# EAGLE design PCB_acquiCapteur_Schema (EAGLE 9.6.2)
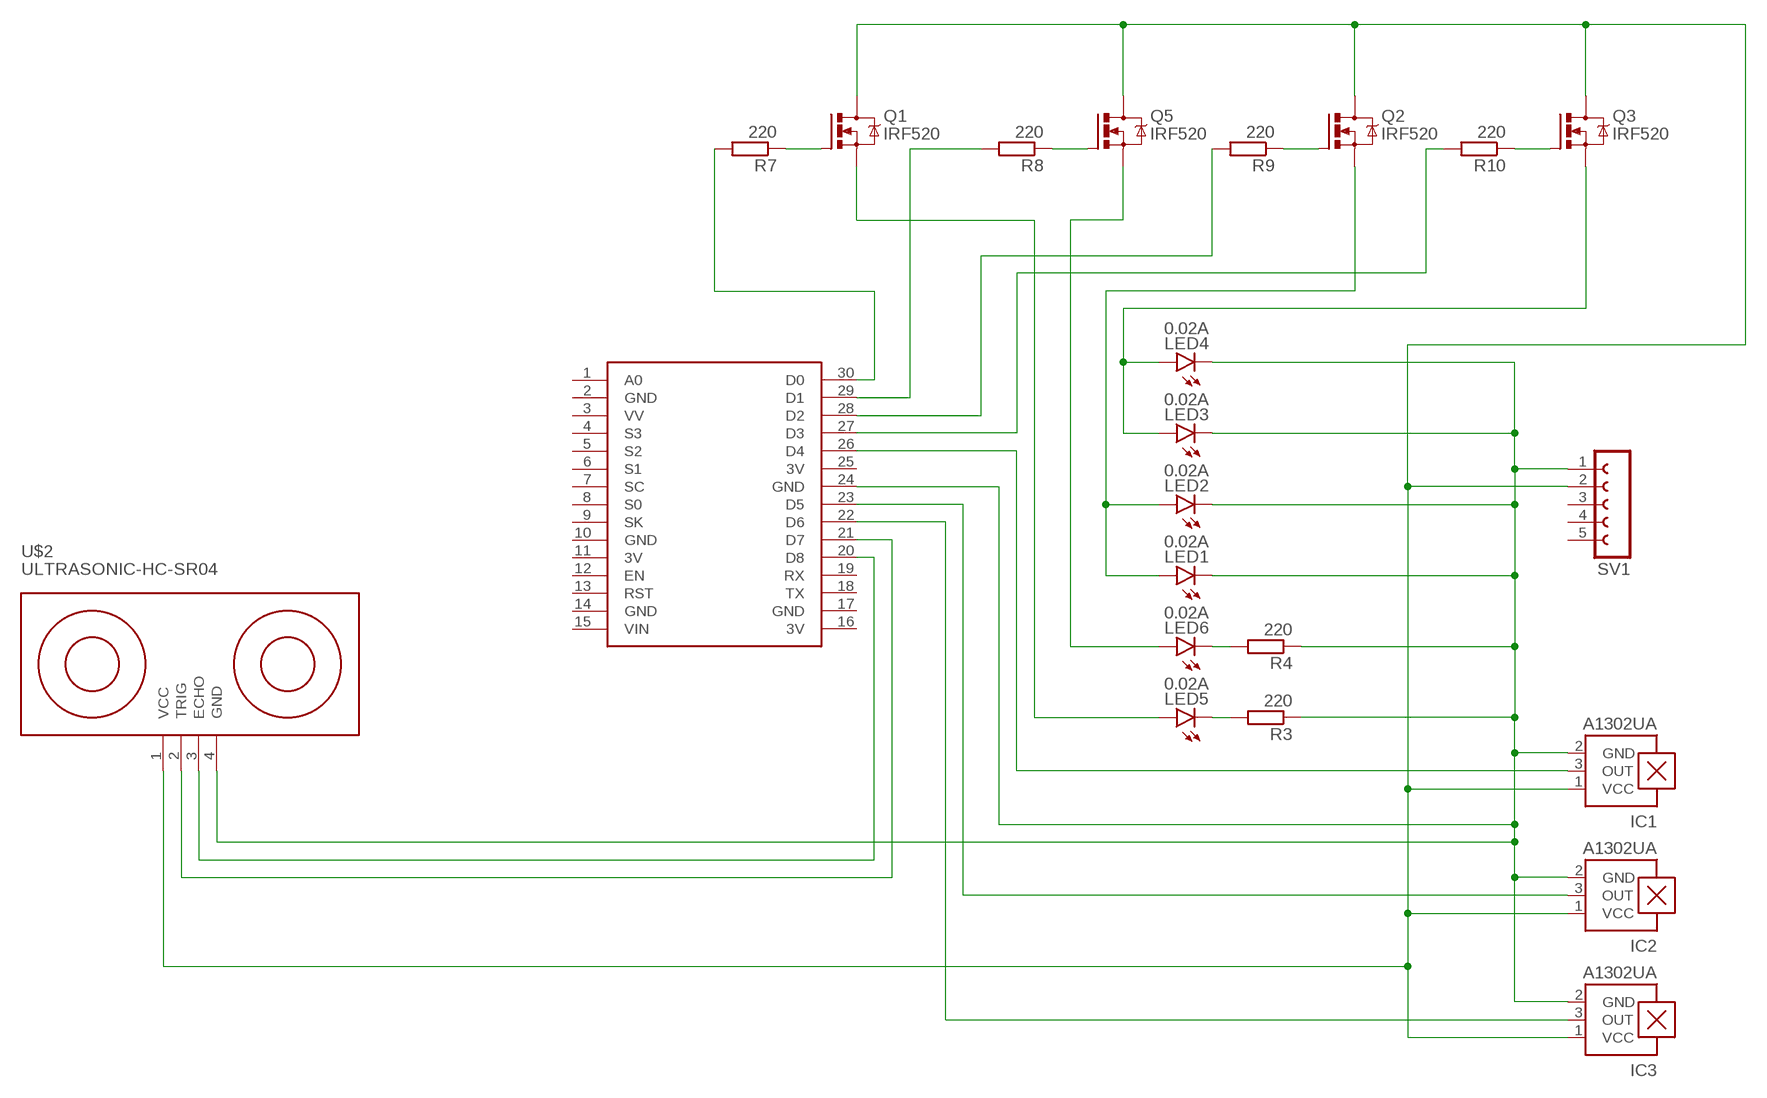
[diagram p0: schematic, sheet 1]

## Parts
IC1  A1302UA  [SIP3-UA]
IC2  A1302UA  [SIP3-UA]
IC3  A1302UA  [SIP3-UA]
LED1  0.02A  LEDLSU260  [LSU260]
LED2  0.02A  LEDLSU260  [LSU260]
LED3  0.02A  LEDLSU260  [LSU260]
LED4  0.02A  LEDLSU260  [LSU260]
LED5  0.02A  LEDLSU260  [LSU260]
LED6  0.02A  LEDLSU260  [LSU260]
Q1  IRF520  NMOSFET_IRF520-TO220  [TO220BV]
Q2  IRF520  NMOSFET_IRF520-TO220  [TO220BV]
Q3  IRF520  NMOSFET_IRF520-TO220  [TO220BV]
Q5  IRF520  NMOSFET_IRF520-TO220  [TO220BV]
R3  220  R-EU_0207/10  [0207/10]
R4  220  R-EU_0207/10  [0207/10]
R7  220  R-EU_0207/10  [0207/10]
R8  220  R-EU_0207/10  [0207/10]
R9  220  R-EU_0207/10  [0207/10]
R10  220  R-EU_0207/10  [0207/10]
SV1  FE05-1  [FE05-1]
U$1  NODEMCU  [NODEMCU]
U$2  ULTRASONIC-HC-SR04  [ULTRASONIC-HC-SR04]

## Nets
N$2: LED5.K(C) R3.2
N$3: LED6.K(C) R4.2
N$7: IC1.2(GND) IC2.2(GND) IC3.2(GND) LED1.K(C) LED2.K(C) LED3.K(C) LED4.K(C) R3.1 R4.1 SV1.1 U$1.24(GND) U$2.4(GND)
N$8: Q1.G R7.1
N$9: Q5.G R8.1
N$10: Q2.G R9.1
N$11: IC1.3(OUT) U$1.26(D4)
N$12: IC2.3(OUT) U$1.23(D5)
N$13: IC3.3(OUT) U$1.22(D6)
N$14: IC1.1(VCC) IC2.1(VCC) IC3.1(VCC) Q1.D Q2.D Q3.D Q5.D SV1.2 U$2.1(VCC)
N$15: U$1.20(D8) U$2.3(ECHO)
N$16: U$1.21(D7) U$2.2(TRIG)
N$17: Q3.G R10.1
N$18: R7.2 U$1.30(D0)
N$19: R8.2 U$1.29(D1)
N$20: R9.2 U$1.28(D2)
N$22: LED3.A LED4.A Q3.S
N$23: LED1.A LED2.A Q2.S
N$24: LED6.A Q5.S
N$25: LED5.A Q1.S
N$26: R10.2 U$1.27(D3)
Unconnected: SV1.3 SV1.4 SV1.5 U$1.1(A0) U$1.3(VV) U$1.4(S3) U$1.5(S2) U$1.6(S1) U$1.7(SC) U$1.8(S0) U$1.9(SK) U$1.12(EN) U$1.13(RST) U$1.15(VIN) U$1.18(TX) U$1.19(RX)

## Power pins joined to a net without a drawn wire
3V: U$1.11(3V) U$1.16(3V) U$1.25(3V)
GND: U$1.2(GND) U$1.10(GND) U$1.14(GND) U$1.17(GND)

## Library data of the parts
IC1-IC3 = allegro:A13*?: Linear Hall Effect Sensor ICs Continuous-Time Ratiometric High-Temperature Operation Programmable Linear with Analog Output A1302 -Replacement- UGN3503 Source: http://www.allegromicro.com/en/Products/Part_Numbers/1301/1301.pdf http://www.allegromicro.com/en/Products/Part_Numbers/1321/1321.pdf http://www.allegromicro.com/en/Products/Part_Numbers/1381/1381.pdf; MF: ALLEGRO MICROSYSTEMS, INC.; MPN: A1302EUA-T; OC_FARNELL: 1521708; OC_NEWARK: 31K6639
LED1-LED6 = led:LED: LED OSRAM: - CHIPLED LG R971, LG N971, LY N971, LG Q971, LY Q971, LO R971, LY R971 LH N974, LH R974 LS Q976, LO Q976, LY Q976 LO Q996 - Hyper CHIPLED LW Q18S LB Q993, LB Q99A, LB R99A - SideLED LS A670, LO A670, LY A670, LG A670, LP A670 LB A673, LV A673, LT A673, LW A673 LH A674 LY A675 LS A676, LA A676, LO A676, LY A676, LW A676 LS A679, LY A679, LG A679 - Hyper Micro SIDELED® LS Y876, LA Y876, LO Y876, LY Y876 LT Y87S - SmartLED LW L88C, LW L88S LB L89C, LB L89S, LG L890 LS L89K, LO L89K, LY L89K LS L896, LA L896, LO L896, LY L896 - TOPLED LS T670, LO T670, LY T670, LG T670, LP T670 LSG T670, LSP T670, LSY T670, LOP T670, LYG T670 LG T671, LOG T671, LSG T671 LB T673, LV T673, LT T673, LW T673 LH T674 LS T676, LA T676, LO T676, LY T676, LB T676, LH T676, LSB T676, LW T676 LB T67C, LV T67C, LT T67C, LS T67K, LO T67K, LY T67K, LW E67C LS E67B, LA E67B, LO E67B, LY E67B, LB E67C, LV E67C, LT E67C LW T67C LS T679, LY T679, LG T679 LS T770, LO T770, LY T770, LG T770, LP T770 LB T773, LV T773, LT T773, LW T773 LH T774 LS E675, LA E675, LY E675, LS T675 LS T776, LA T776, LO T776, LY T776, LB T776 LHGB T686 LT T68C, LB T68C - Hyper Mini TOPLED® LB M676 - Mini TOPLED Santana® LG M470 LS M47K, LO M47K, LY M47K Source: http://www.osram.convergy.de LUXEON: - LUMILED® LXK2-PW12-R00, LXK2-PW12-S00, LXK2-PW14-U00, LXK2-PW14-V00 LXK2-PM12-R00, LXK2-PM12-S00, LXK2-PM14-U00 LXK2-PE12-Q00, LXK2-PE12-R00, LXK2-PE12-S00, LXK2-PE14-T00, LXK2-PE14-U00 LXK2-PB12-K00, LXK2-PB12-L00, LXK2-PB12-M00, LXK2-PB14-N00, LXK2-PB14-P00, LXK2-PB14-Q00 LXK2-PR12-L00, LXK2-PR12-M00, LXK2-PR14-Q00, LXK2-PR14-R00 LXK2-PD12-Q00, LXK2-PD12-R00, LXK2-PD12-S00 LXK2-PH12-R00, LXK2-PH12-S00 LXK2-PL12-P00, LXK2-PL12-Q00, LXK2-PL12-R00 Source: www.luxeon.com KINGBRIGHT: KA-3528ASYC Source: www.kingbright.com
Q1-Q3 Q5 = Transistor:NMOSFET_: N-Channel MOSFET - Popular parts; CATEGORY: Transistor; DESCRIPTION: MOSFET N-CH 100V 9.7A TO-220AB; DRAIN_CURRENT: 9.7A; MANUFACTURER: Infineon Technologies; MPN: IRF520NPBF; OPERATING_TEMP: -55°C ~ 175°C; PART_STATUS: Active; ROHS_COMPLIANT: Yes; SUB-CATEGORY: MOSFET; THERMALLOSS: 48W; TYPE: N-Channel
R3 R4 R7-R10 = rcl:R-EU_: RESISTOR, European symbol; SPICEPREFIX: R
SV1 = con-lsta:FE05-1: FEMALE HEADER; OC_FARNELL: unknown; OC_NEWARK: unknown
U$1 = nodemcu:NODEMCU
U$2 = diy-modules:ULTRASONIC-HC-SR04: Ultrasonic Ranging Module HC-SR04 More details available here: http://randomnerdtutorials.com/complete-guide-for-ultrasonic-sensor-hc-sr04/ Click here to find device on ebay.com <http://www.ebay.com/sch/hc+sr04+ultrasonic>

## Board
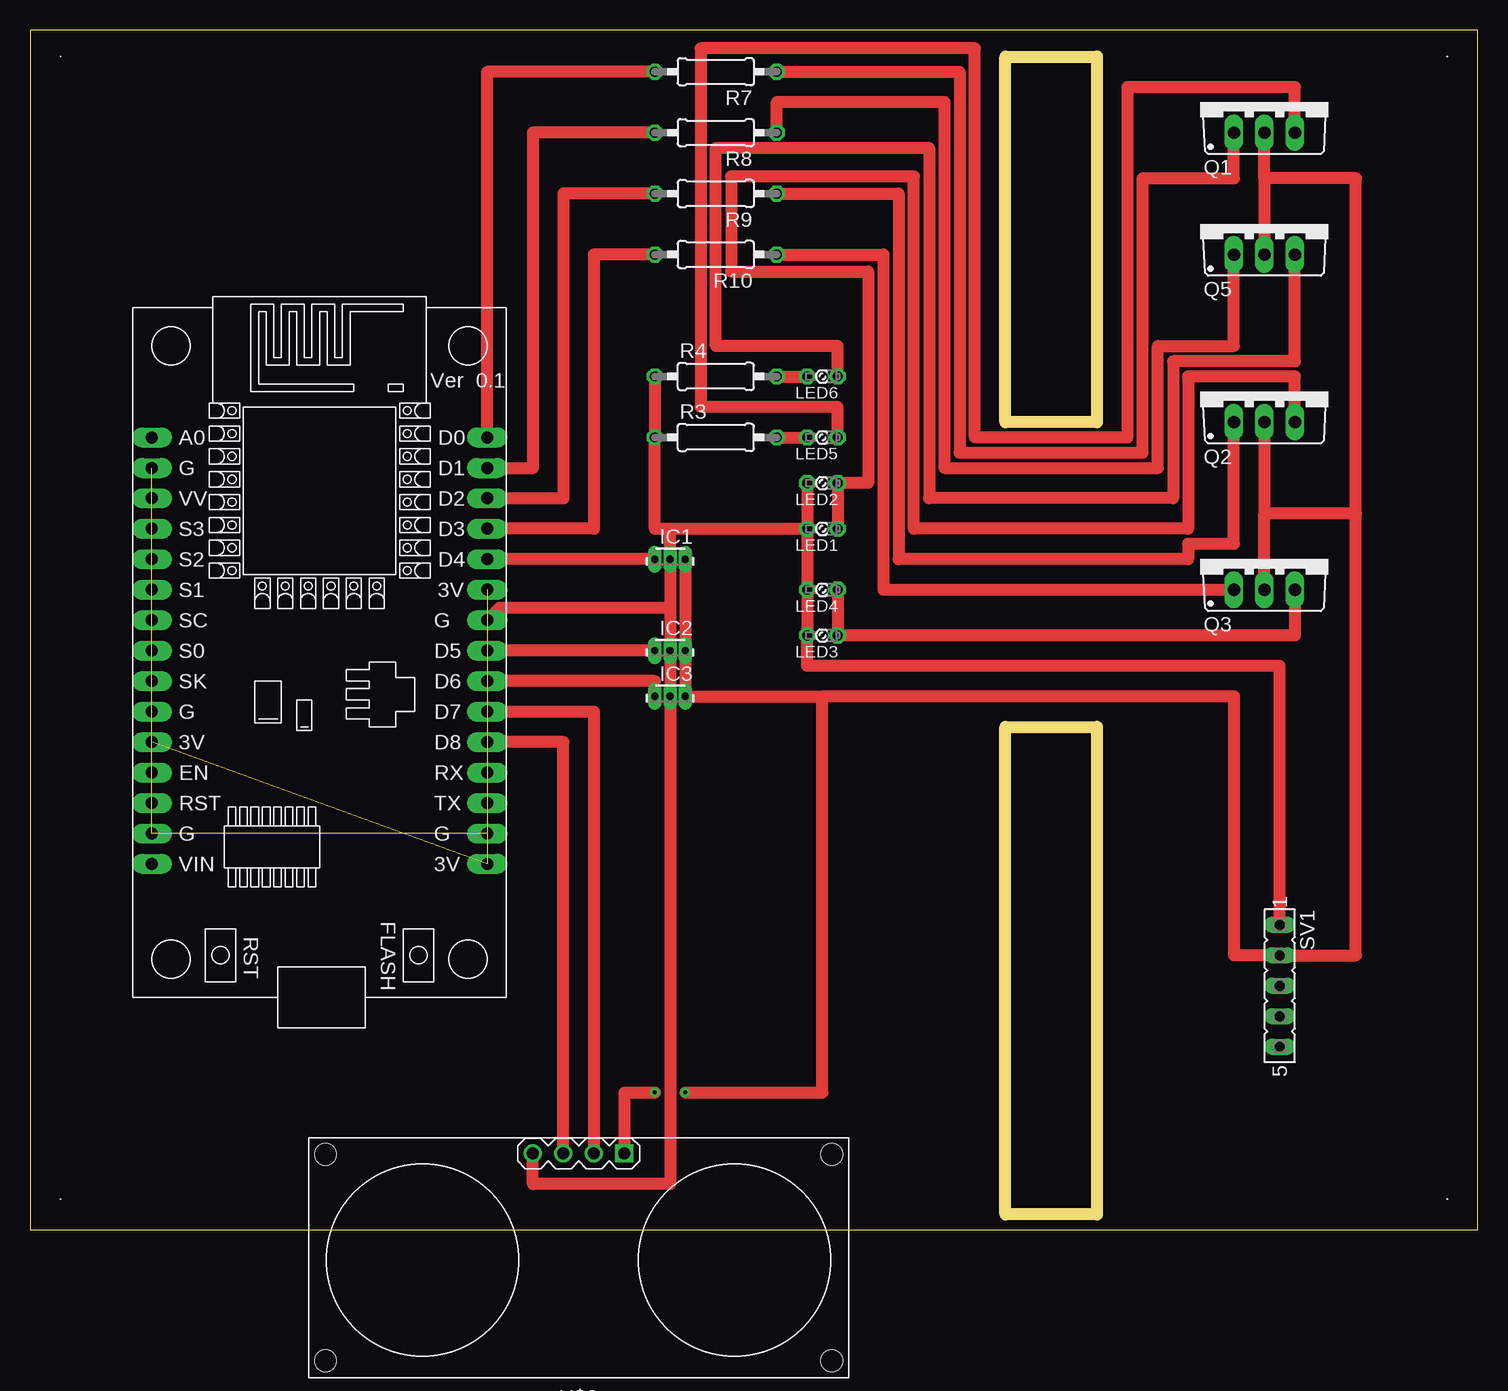
[diagram p1: board, top side]
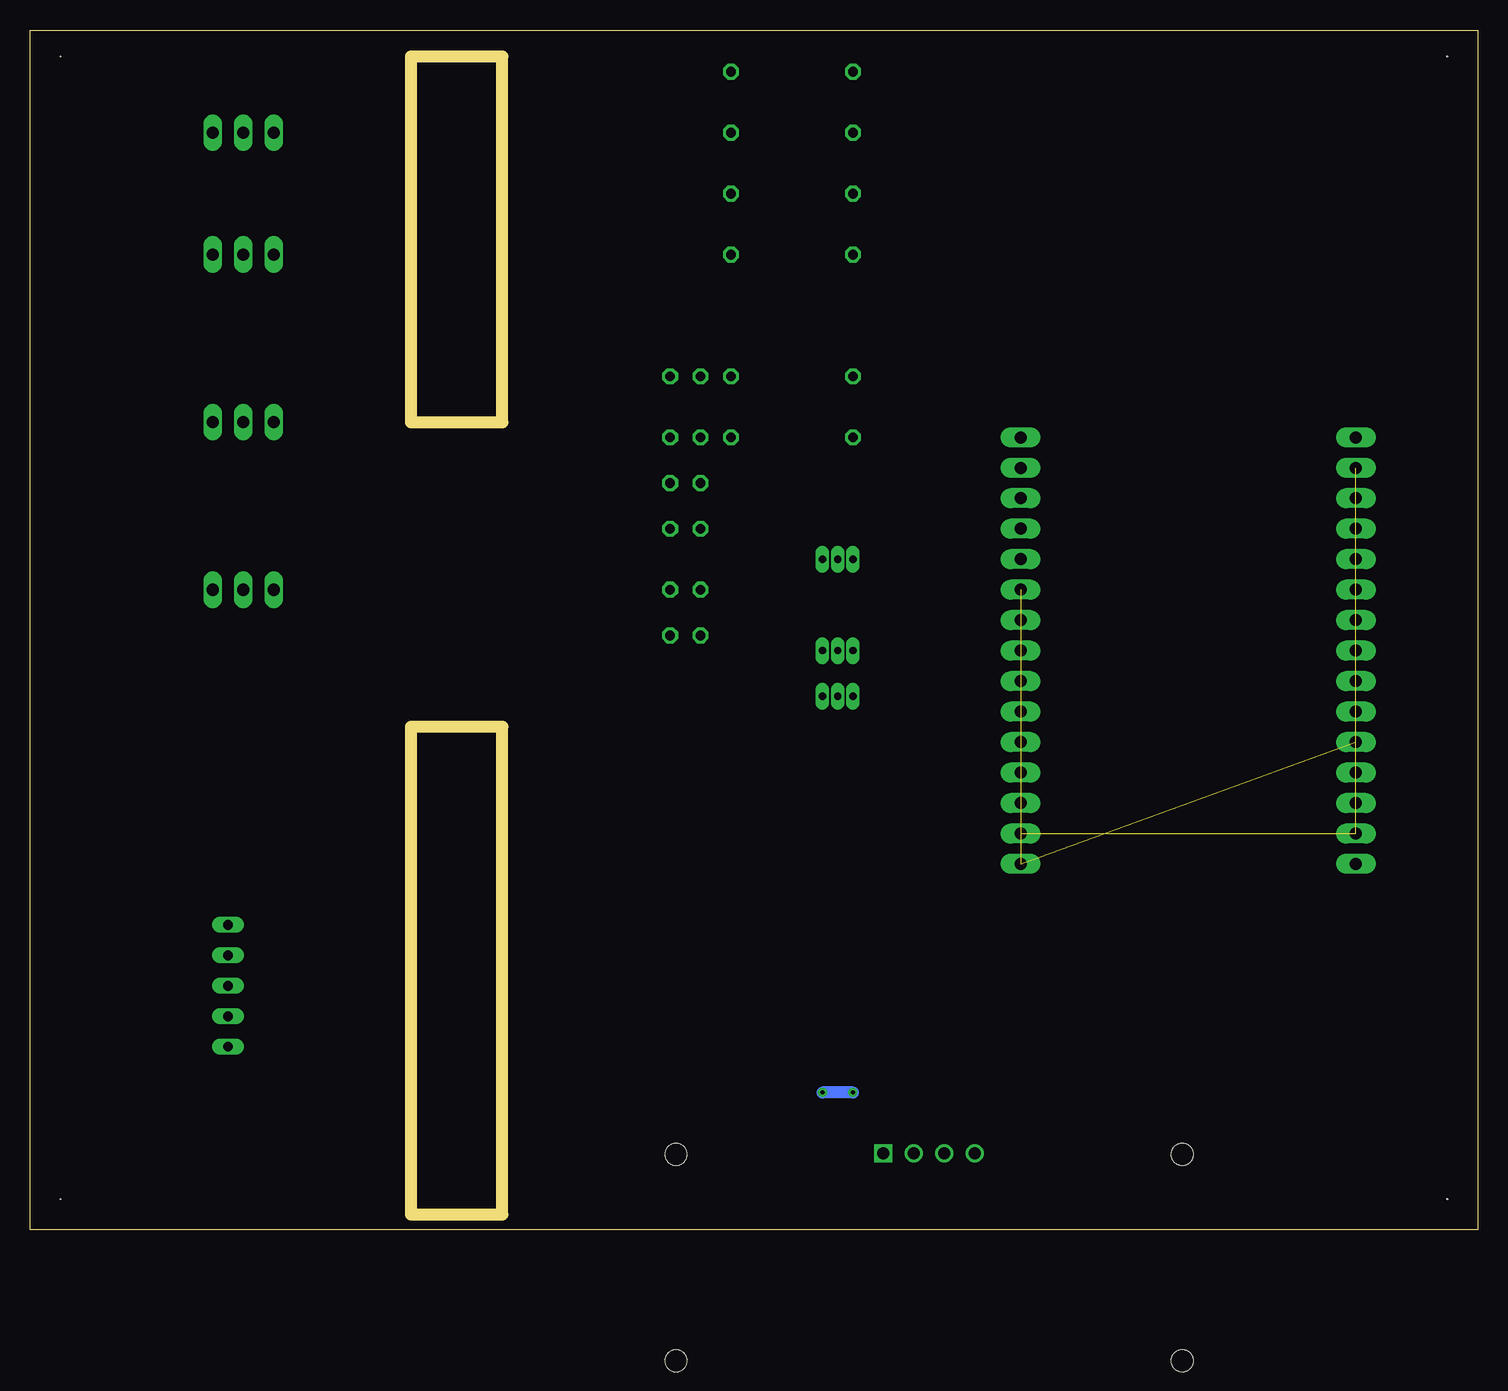
[diagram p2: board, bottom side, seen from below]

Size 120.65 x 100 mm. Coordinates in mm from the lower left corner, seen from the top.
Outline: 0,0 120.63,0 120.63,32.97 120.65,33.07 120.63,100 0,100 0,0
Copper layers (1*16): Top 0.035mm / dielectric 1.5mm / Bottom 0.035mm
Design rules "default": minimum track width 6mil, minimum drill 0.35mm, track to track 6mil, track to pad 6mil, pad to pad 6mil, via to via 6mil, smd to smd 6mil, copper to edge 40mil, drill to drill 6mil, minimum pad ring 10mil, minimum via ring 8mil, stop-mask expansion 4mil, vias tented up to drill 0mil, thermal gap 10mil
Holes 0.06 mm at 2.54,97.79 2.54,2.54 118.11,2.54 118.11,97.79
Milling: 8 lines

### Footprints (pad centres in the part's own frame; a part is rotated, then mirrored left to right if it is on the bottom)
SIP3-UA = drill 0.6 pad 0.7 long: 1 -1.27,0; 2 0,0; 3 1.27,0
LSU260 = drill 0.813 octagon: A -1.27,0; K 1.27,0
TO220BV = drill 1.016 long: D 0,-2.54; G -2.54,-2.54; S 2.54,-2.54
0207/10 = drill 0.813 octagon: 1 -5.08,0; 2 5.08,0
FE05-1 = drill 0.813 long: 1 -5.08,0; 2 -2.54,0; 3 0,0; 4 2.54,0; 5 5.08,0
NODEMCU = drill 1 pad 1.676 long: 1 -13.97,17.78; 2 -13.97,15.24; 3 -13.97,12.7; 4 -13.97,10.16; 5 -13.97,7.62; 6 -13.97,5.08; 7 -13.97,2.54; 8 -13.97,0; 9 -13.97,-2.54; 10 -13.97,-5.08; 11 -13.97,-7.62; 12 -13.97,-10.16; 13 -13.97,-12.7; 14 -13.97,-15.24; 15 -13.97,-17.78; 16 13.97,-17.78; 17 13.97,-15.24; 18 13.97,-12.7; 19 13.97,-10.16; 20 13.97,-7.62; 21 13.97,-5.08; 22 13.97,-2.54; 23 13.97,0; 24 13.97,2.54; 25 13.97,5.08; 26 13.97,7.62; 27 13.97,10.16; 28 13.97,12.7; 29 13.97,15.24; 30 13.97,17.78
ULTRASONIC-HC-SR04 = drill 1 square: 1 -3.81,-8.89 | drill 1: 2 -1.27,-8.89; 3 1.27,-8.89; 4 3.81,-8.89 | hole 1.8: -21.1,8.4; -21.1,-8.8; 21.1,-8.8; 21.1,8.4

### Placement (x,y rotation side)
IC1  53.34,55.88 180 top
IC2  53.34,48.26 180 top
IC3  53.34,44.45 180 top
LED1  66.04,58.42 180 top
LED2  66.04,62.23 180 top
LED3  66.04,49.53 180 top
LED4  66.04,53.34 180 top
LED5  66.04,66.04 180 top
LED6  66.04,71.12 180 top
Q1  102.87,93.98 0 top
Q2  102.87,69.85 0 top
Q3  102.87,55.88 0 top
Q5  102.87,83.82 0 top
R3  57.15,66.04 0 top
R4  57.15,71.12 0 top
R7  57.15,96.52 180 top
R8  57.15,91.44 180 top
R9  57.15,86.36 180 top
R10  57.15,81.28 180 top
SV1  104.14,20.32 270 top
U$1  24.13,48.26 0 top
U$2  45.72,-2.54 180 top

### Tracks (layer width: path | path; a pad name or v marks a point on that pad's centre or on a via)
3V  (2 unrouted)
GND  (3 unrouted)
N$2
  Top 1.016: R3.2 LED5.K
N$3
  Top 1.016: R4.2 LED6.K
N$7
  Top 1.016: 53.34,51.84 IC2.2 IC3.2 53.34,3.81 41.91,3.81 U$2.4 | U$1.24 39.14,51.84 53.34,51.84 | 53.34,58.42 IC1.2 53.34,51.84 | R4.1 R3.1 52.07,58.42 53.34,58.42 | LED2.K LED1.K | SV1.1 104.14,46.99 64.77,46.99 LED3.K LED4.K LED1.K | 53.34,58.42 LED1.K
N$8
  Top 1.016: R7.1 77.47,96.52 77.47,64.77 92.71,64.77 92.71,87.63 100.33,87.63 Q1.G
N$9
  Top 1.016: R8.1 62.23,93.98 76.2,93.98 76.2,63.5 93.98,63.5 93.98,73.66 100.33,73.66 Q5.G
N$10
  Top 1.016: 62.23,86.21 R9.1 72.39,86.36 72.39,55.88 96.52,55.88 96.52,57.15 100.33,57.15 Q2.G
N$11
  Top 1.016: IC1.3 U$1.26
N$12
  Top 1.016: IC2.3 U$1.23
N$13
  Top 1.016: IC3.3 52.07,45.72 U$1.22
N$14  (via drill 0.35)
  Top 1.016: 110.49,59.69 110.49,22.86 SV1.2 100.33,22.86 100.33,44.45 66.04,44.45 | 102.87,87.63 110.49,87.63 110.49,59.69 | 102.87,87.63 Q1.D | 102.87,87.63 Q5.D | Q2.D 102.87,59.69 | Q3.D 102.87,59.69 | 66.04,44.45 IC3.1 IC2.1 IC1.1 | U$2.1 49.53,11.43 v52.07,11.43 | v54.61,11.43 66.04,11.43 66.04,44.45 | 110.49,59.69 102.87,59.69
  Bottom 1.016: v52.07,11.43 v54.61,11.43
N$15
  Top 1.016: U$2.3 44.45,40.64 U$1.20
N$16
  Top 1.016: U$1.21 46.99,43.18 U$2.2
N$17
  Top 1.016: R10.1 71.12,81.28 71.12,53.34 Q3.G
N$18
  Top 1.016: U$1.30 38.1,96.52 R7.2
N$19
  Top 1.016: R8.2 41.91,91.44 41.91,63.5 U$1.29
N$20
  Top 1.016: R9.2 44.45,86.36 44.45,60.96 U$1.28
N$22
  Top 1.016: LED4.A LED3.A 105.41,49.53 Q3.S
N$23
  Top 1.016: LED1.A LED2.A 69.85,62.23 69.85,79.86 58.42,79.86 58.42,87.78 73.66,87.78 73.66,58.42 96.52,58.42 96.52,71.12 105.41,71.12 Q2.S
N$24
  Top 1.016: LED6.A 67.31,73.66 57.15,73.66 57.15,90.17 74.93,90.17 74.93,60.96 95.25,60.96 95.25,72.39 105.41,72.39 Q5.S
N$25
  Top 1.016: LED5.A 67.31,68.58 55.88,68.58 55.88,98.48 78.74,98.48 78.74,66.04 91.44,66.04 91.44,95.25 105.41,95.25 Q1.S
N$26
  Top 1.016: R10.2 46.99,81.28 46.99,58.42 U$1.27
(copper drawn outside any net)
  shapes: Top area x2